# EAGLE design riffle-proto-0.1 (EAGLE 7.3.0)
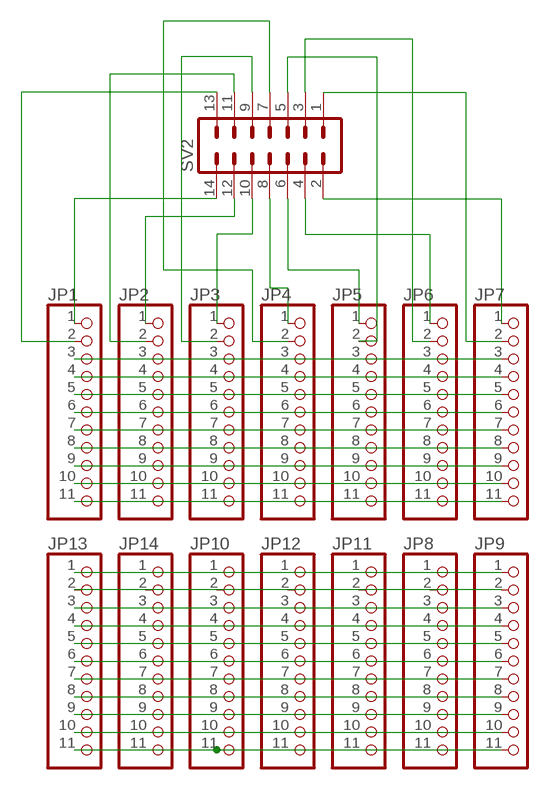
[diagram p0: schematic, sheet 1]

## Parts
JP1  HEADER-1X1176MIL  [1X11_ROUND_76]
JP2  HEADER-1X1176MIL  [1X11_ROUND_76]
JP3  HEADER-1X1176MIL  [1X11_ROUND_76]
JP4  HEADER-1X1176MIL  [1X11_ROUND_76]
JP5  HEADER-1X1176MIL  [1X11_ROUND_76]
JP6  HEADER-1X1176MIL  [1X11_ROUND_76]
JP7  HEADER-1X1176MIL  [1X11_ROUND_76]
JP8  HEADER-1X1176MIL  [1X11_ROUND_76]
JP9  HEADER-1X1176MIL  [1X11_ROUND_76]
JP10  HEADER-1X1176MIL  [1X11_ROUND_76]
JP11  HEADER-1X1176MIL  [1X11_ROUND_76]
JP12  HEADER-1X1176MIL  [1X11_ROUND_76]
JP13  HEADER-1X1176MIL  [1X11_ROUND_76]
JP14  HEADER-1X1176MIL  [1X11_ROUND_76]
SV2  MA07-2  [MA07-2]

## Nets
N$1: JP1.1 SV2.14
N$2: JP2.1 SV2.12
N$3: JP3.1 SV2.10
N$4: JP4.1 SV2.8
N$5: JP5.1 SV2.6
N$6: JP6.1 SV2.4
N$7: JP7.1 SV2.2
N$8: JP1.2 SV2.13
N$9: JP2.2 SV2.11
N$10: JP3.2 SV2.9
N$11: JP4.2 SV2.7
N$12: JP5.2 SV2.5
N$13: JP6.2 SV2.3
N$14: JP7.2 SV2.1
N$15: JP1.3 JP2.3 JP3.3 JP4.3 JP5.3 JP6.3 JP7.3
N$16: JP1.4 JP2.4 JP3.4 JP4.4 JP5.4 JP6.4 JP7.4
N$17: JP1.5 JP2.5 JP3.5 JP4.5 JP5.5 JP6.5 JP7.5
N$18: JP1.6 JP2.6 JP3.6 JP4.6 JP5.6 JP6.6 JP7.6
N$19: JP1.7 JP2.7 JP3.7 JP4.7 JP5.7 JP6.7 JP7.7
N$20: JP1.8 JP2.8 JP3.8 JP4.8 JP5.8 JP6.8 JP7.8
N$21: JP1.9 JP2.9 JP3.9 JP4.9 JP5.9 JP6.9 JP7.9
N$22: JP1.10 JP2.10 JP3.10 JP4.10 JP5.10 JP6.10 JP7.10
N$23: JP1.11 JP2.11 JP4.11 JP5.11 JP6.11 JP7.11
N$24: JP8.1 JP9.1 JP10.1 JP11.1 JP12.1 JP13.1 JP14.1
N$25: JP8.2 JP9.2 JP10.2 JP11.2 JP12.2 JP13.2 JP14.2
N$38: JP8.3 JP9.3 JP10.3 JP11.3 JP12.3 JP13.3 JP14.3
N$39: JP8.4 JP9.4 JP10.4 JP11.4 JP12.4 JP13.4 JP14.4
N$40: JP8.5 JP9.5 JP10.5 JP11.5 JP12.5 JP13.5 JP14.5
N$41: JP8.6 JP9.6 JP10.6 JP11.6 JP12.6 JP13.6 JP14.6
N$42: JP8.7 JP9.7 JP10.7 JP11.7 JP12.7 JP13.7 JP14.7
N$43: JP8.8 JP9.8 JP10.8 JP11.8 JP12.8 JP13.8 JP14.8
N$44: JP8.9 JP9.9 JP10.9 JP11.9 JP12.9 JP13.9 JP14.9
N$45: JP8.10 JP9.10 JP10.10 JP11.10 JP12.10 JP13.10 JP14.10
N$46: JP8.11 JP9.11 JP10.11 JP11.11 JP12.11 JP13.11 JP14.11
Unconnected: JP3.11

## Library data of the parts
JP1-JP14 = microbuilder:HEADER-1X11
SV2 = con-lstb:MA07-2: PIN HEADER; OC_FARNELL: unknown; OC_NEWARK: unknown

## Board
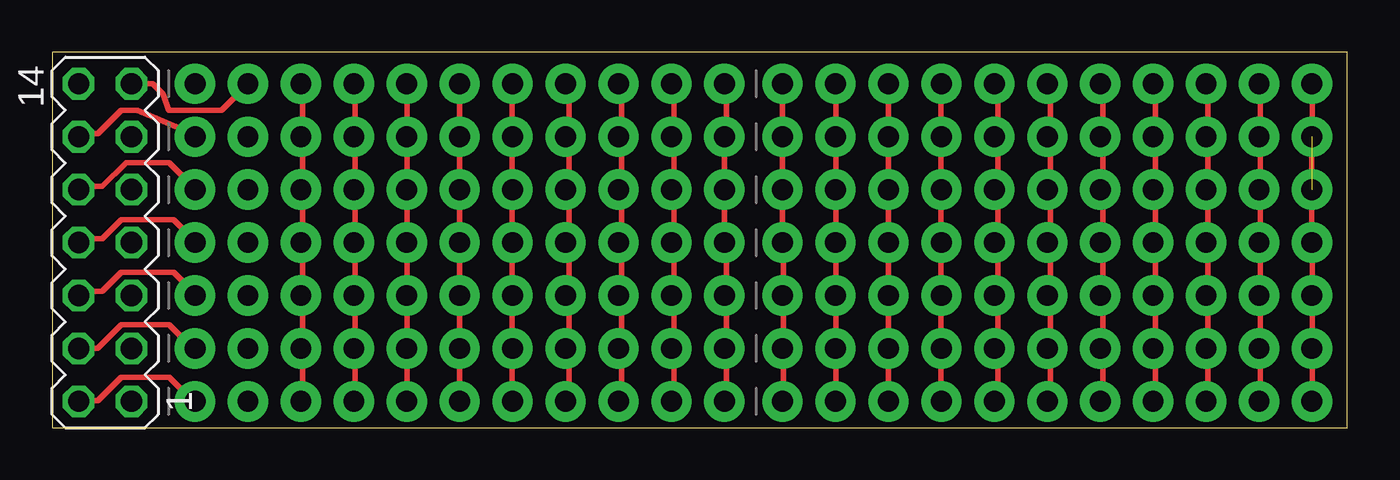
[diagram p1: board, top side]
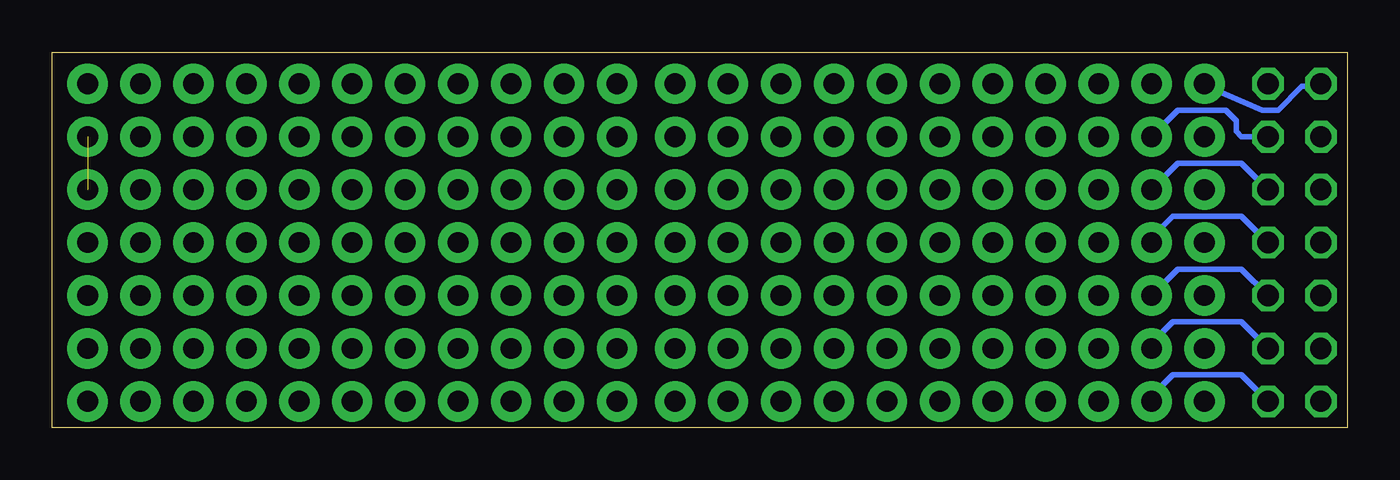
[diagram p2: board, bottom side, seen from below]

Size 62.15 x 18.02 mm. Coordinates in mm from the lower left corner, seen from the top.
Outline: 0,0 62.15,0 62.15,18.02 0,18.02 0,0
Copper layers (1*16): Top 0.035mm / dielectric 1.5mm / Bottom 0.035mm
Design rules "default": minimum track width 10mil, minimum drill 24mil, track to track 8mil, track to pad 8mil, pad to pad 8mil, via to via 8mil, smd to smd 8mil, copper to edge 40mil, drill to drill 8mil, minimum pad ring 10mil, minimum via ring 8mil, stop-mask expansion 4mil, vias tented up to drill 0mil, thermal gap 10mil

### Footprints (pad centres in the part's own frame; a part is rotated, then mirrored left to right if it is on the bottom)
1X11_ROUND_76 = drill 1 pad 1.93: 1 -12.7,0; 2 -10.16,0; 3 -7.62,0; 4 -5.08,0; 5 -2.54,0; 6 0,0; 7 2.54,0; 8 5.08,0; 9 7.62,0; 10 10.16,0; 11 12.7,0
MA07-2 = drill 1.016 octagon: 1 -7.62,-1.27; 2 -7.62,1.27; 3 -5.08,-1.27; 4 -5.08,1.27; 5 -2.54,-1.27; 6 -2.54,1.27; 7 0,-1.27; 8 0,1.27; 9 2.54,-1.27; 10 2.54,1.27; 11 5.08,-1.27; 12 5.08,1.27; 13 7.62,-1.27; 14 7.62,1.27

### Placement (x,y rotation side)
JP1  19.56,16.51 0 top
JP2  19.56,13.97 0 top
JP3  19.56,11.43 0 top
JP4  19.56,8.89 0 top
JP5  19.56,6.35 0 top
JP6  19.56,3.81 0 top
JP7  19.56,1.27 0 top
JP8  47.75,16.51 0 top
JP9  47.75,13.97 0 top
JP10  47.75,11.43 0 top
JP11  47.75,8.89 0 top
JP12  47.75,6.35 0 top
JP13  47.75,3.81 0 top
JP14  47.75,1.27 0 top
SV2  2.54,8.89 90 top

### Tracks (layer width: path | path; a pad name or v marks a point on that pad's centre or on a via)
N$1
  Bottom 0.254: SV2.14 1.27,16.38 2.18,16.38 3.33,15.24 4.09,15.24 6.76,16.38 JP1.1
N$2
  Top 0.254: SV2.12 1.27,14.1 2.18,14.1 3.33,15.24 4.09,15.24 6.76,14.1 JP2.1
N$3
  Top 0.254: SV2.10 1.27,11.58 2.41,11.58 3.56,12.72 5.61,12.72 6.76,11.58 JP3.1
N$4
  Top 0.254: SV2.8 1.27,9.07 2.41,9.07 3.33,9.98 5.84,9.98 6.76,9.07 JP4.1
N$5
  Top 0.254: SV2.6 1.27,6.55 2.41,6.55 3.33,7.47 5.84,7.47 6.76,6.55 JP5.1
N$6
  Top 0.254: SV2.4 2.18,3.81 3.33,4.95 5.61,4.95 6.76,3.81 JP6.1
N$7
  Top 0.254: SV2.2 1.27,1.29 2.18,1.29 3.33,2.44 5.61,2.44 6.76,1.29 JP7.1
N$8
  Top 0.254: SV2.13 4.83,16.51 5.33,16 5.59,15.24 8.13,15.24 JP1.2
N$9
  Bottom 0.254: SV2.11 5.08,13.97 5.33,14.22 5.33,14.73 5.84,15.24 8.13,15.24 JP2.2
N$10
  Bottom 0.254: SV2.9 5.08,12.7 8.13,12.7 JP3.2
N$11
  Bottom 0.254: SV2.7 5.08,10.16 8.38,10.16 9.4,9.14 JP4.2
N$12
  Bottom 0.254: SV2.5 5.08,7.62 8.13,7.62 JP5.2
N$13
  Bottom 0.254: SV2.3 5.08,5.08 8.38,5.08 9.4,4.06 JP6.2
N$14
  Bottom 0.254: SV2.1 5.08,2.54 8.38,2.54 9.4,1.52 JP7.2
N$15
  Top 0.254: JP1.3 12.01,16.38 12.01,14.1 JP2.3 12.01,13.87 12.01,11.58 JP3.3 12.01,11.35 12.01,9.07 JP4.3 12.01,8.84 12.01,6.55 JP5.3 12.01,6.32 12.01,3.81 | 12.01,3.81 12.01,1.29 JP7.3 | 12.01,3.81 JP6.3
N$16
  Top 0.254: JP1.4 14.53,16.38 14.53,14.1 JP2.4 14.53,13.87 14.53,11.58 JP3.4 14.53,11.35 14.53,9.07 JP4.4 14.53,8.84 14.53,6.55 JP5.4 14.53,6.32 14.53,3.81 | 14.53,3.81 14.53,1.29 JP7.4 | 14.53,3.81 JP6.4
N$17
  Top 0.254: JP1.5 17.04,16.38 17.04,14.1 JP2.5 17.04,13.87 17.04,11.58 JP3.5 17.04,11.35 17.04,9.07 JP4.5 17.04,8.84 17.04,6.55 JP5.5 17.04,6.32 17.04,3.81 | 17.04,3.81 17.04,1.29 JP7.5 | 17.04,3.81 JP6.5
N$18
  Top 0.254: JP1.6 JP2.6 JP3.6 JP4.6 JP5.6 JP6.6 JP7.6
N$19
  Top 0.254: JP1.7 22.07,16.38 22.07,14.1 JP2.7 22.07,13.87 22.07,11.58 JP3.7 22.07,11.35 22.07,9.07 JP4.7 22.07,8.84 22.07,6.55 JP5.7 22.07,6.32 22.07,3.81 | 22.07,3.81 22.07,1.29 JP7.7 | 22.07,3.81 JP6.7
N$20
  Top 0.254: JP1.8 24.82,16.38 24.82,14.1 JP2.8 24.82,13.87 24.82,11.58 JP3.8 24.82,11.35 24.82,9.07 JP4.8 24.82,8.84 24.82,6.55 JP5.8 24.82,6.32 24.82,3.81 | 24.82,3.81 24.82,1.29 JP7.8 | 24.82,3.81 JP6.8
N$21
  Top 0.254: JP1.9 27.33,16.38 27.33,14.1 JP2.9 27.33,13.87 27.33,11.58 JP3.9 27.33,11.35 27.33,9.07 JP4.9 27.33,8.84 27.33,6.55 JP5.9 27.33,6.32 27.33,3.81 | 27.33,3.81 27.33,1.29 JP7.9 | 27.33,3.81 JP6.9
N$22
  Top 0.254: JP1.10 29.84,16.38 29.84,14.1 JP2.10 29.84,13.87 29.84,11.58 JP3.10 29.84,11.35 29.84,9.07 JP4.10 29.84,8.84 29.84,6.55 JP5.10 29.84,6.32 29.84,3.81 | 29.84,3.81 29.84,1.29 JP7.10 | 29.84,3.81 JP6.10
N$23
  Top 0.254: JP1.11 32.36,16.38 32.36,14.1 JP2.11 JP4.11 32.36,8.84 32.36,6.55 JP5.11 32.36,6.32 32.36,3.81 | 32.36,3.81 32.36,1.29 JP7.11 | 32.36,3.81 JP6.11
N$24
  Top 0.254: JP8.1 JP9.1 JP10.1 JP11.1 35.1,8.84 35.1,6.55 JP12.1 35.1,6.32 35.1,3.81 | 35.1,3.81 35.1,1.29 JP14.1 | 35.1,3.81 JP13.1
N$25
  Top 0.254: JP8.2 37.62,16.38 37.62,14.1 JP9.2 37.62,13.87 37.62,11.58 JP10.2 37.62,11.35 37.62,9.07 JP11.2 37.62,8.84 37.62,6.55 JP12.2 37.62,6.32 37.62,3.81 | 37.62,3.81 37.62,1.29 JP14.2 | 37.62,3.81 JP13.2
N$38
  Top 0.254: JP8.3 JP9.3 JP10.3 JP11.3 JP12.3 JP13.3 JP14.3
N$39
  Top 0.254: JP8.4 42.65,16.38 42.65,14.1 JP9.4 42.65,13.87 42.65,11.58 JP10.4 42.65,11.35 42.65,9.07 JP11.4 42.65,8.84 42.65,6.55 JP12.4 42.65,6.32 42.65,3.81 | 42.65,3.81 42.65,1.29 JP14.4 | 42.65,3.81 JP13.4
N$40
  Top 0.254: JP8.5 45.39,16.38 45.39,14.1 JP9.5 45.39,13.87 45.39,11.58 JP10.5 45.39,11.35 45.39,9.07 JP11.5 45.39,8.84 45.39,6.55 JP12.5 45.39,6.32 45.39,3.81 | 45.39,3.81 45.39,1.29 JP14.5 | 45.39,3.81 JP13.5
N$41
  Top 0.254: JP8.6 47.9,16.38 47.9,14.1 JP9.6 47.9,13.87 47.9,11.58 JP10.6 47.9,11.35 47.9,9.07 JP11.6 47.9,8.84 47.9,6.55 JP12.6 47.9,6.32 47.9,3.81 | 47.9,3.81 47.9,1.29 JP14.6 | 47.9,3.81 JP13.6
N$42
  Top 0.254: JP8.7 50.42,16.38 50.42,14.1 JP9.7 50.42,13.87 50.42,11.58 JP10.7 50.42,11.35 50.42,9.07 JP11.7 50.42,8.84 50.42,6.55 JP12.7 50.42,6.32 50.42,3.81 | 50.42,3.81 50.42,1.29 JP14.7 | 50.42,3.81 JP13.7
N$43
  Top 0.254: JP8.8 52.93,16.38 52.93,14.1 JP9.8 52.93,13.87 52.93,11.58 JP10.8 52.93,11.35 52.93,9.07 JP11.8 52.93,8.84 52.93,6.55 JP12.8 52.93,6.32 52.93,3.81 | 52.93,3.81 52.93,1.29 JP14.8 | 52.93,3.81 JP13.8
N$44
  Top 0.254: JP8.9 55.45,16.38 55.45,14.1 JP9.9 55.45,13.87 55.45,11.58 JP10.9 55.45,11.35 55.45,9.07 JP11.9 55.45,8.84 55.45,6.55 JP12.9 55.45,6.32 55.45,3.81 | 55.45,3.81 55.45,1.29 JP14.9 | 55.45,3.81 JP13.9
N$45
  Top 0.254: JP8.10 57.96,16.38 57.96,14.1 JP9.10 57.96,13.87 57.96,11.58 JP10.10 57.96,11.35 57.96,9.07 JP11.10 57.96,8.84 57.96,6.55 JP12.10 57.96,6.32 57.96,3.81 | 57.96,3.81 57.96,1.29 JP14.10 | 57.96,3.81 JP13.10
N$46  (1 unrouted)
  Top 0.254: JP8.11 60.48,16.38 60.48,14.1 JP9.11 JP11.11 60.48,8.84 60.48,6.55 JP12.11 60.48,6.32 60.48,3.81 | 60.48,3.81 60.48,1.29 JP14.11 | 60.48,3.81 JP13.11